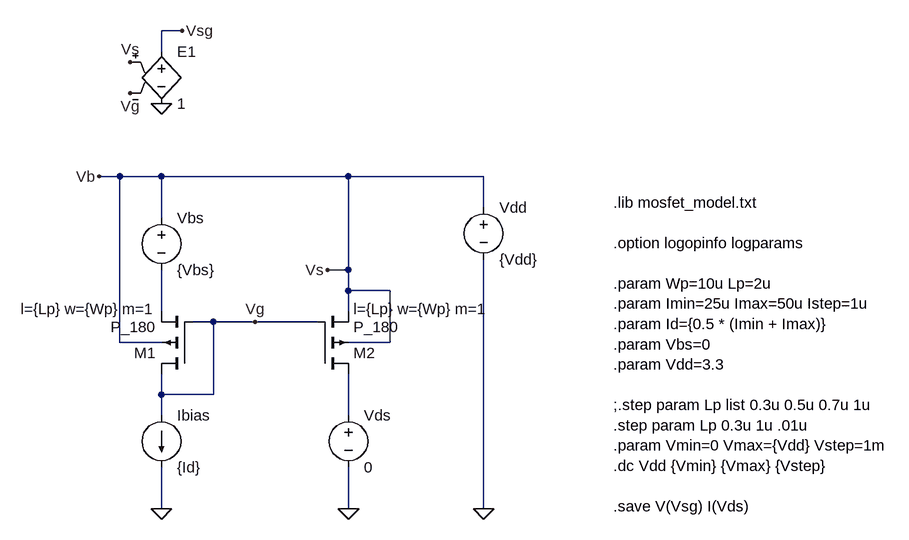
[diagram p0: schematic pmos_mirror.asc]
pmos_mirror.asc, the LTspice schematic file:
Version 4.1
SHEET 1 1372 680
WIRE 224 -416 192 -416
WIRE 192 -384 192 -416
WIRE 128 -192 96 -192
WIRE 192 -192 128 -192
WIRE 480 -192 192 -192
WIRE 688 -192 480 -192
WIRE 688 -144 688 -192
WIRE 192 -128 192 -192
WIRE 480 -48 480 -192
WIRE 480 -48 448 -48
WIRE 480 -16 480 -48
WIRE 544 -16 480 -16
WIRE 192 16 192 -48
WIRE 480 16 480 -16
WIRE 272 32 240 32
WIRE 336 32 272 32
WIRE 432 32 336 32
WIRE 128 64 128 -192
WIRE 192 64 128 64
WIRE 544 64 544 -16
WIRE 544 64 480 64
WIRE 192 144 192 112
WIRE 272 144 272 32
WIRE 272 144 192 144
WIRE 192 176 192 144
WIRE 480 176 480 112
WIRE 192 320 192 256
WIRE 480 320 480 256
WIRE 688 320 688 -64
FLAG 192 320 0
FLAG 688 320 0
FLAG 336 32 Vg
FLAG 96 -192 Vb
FLAG 480 320 0
FLAG 448 -48 Vs
FLAG 192 -304 0
FLAG 144 -320 Vg
FLAG 144 -368 Vs
FLAG 224 -416 Vsg
SYMBOL current 192 176 R0
SYMATTR InstName Ibias
SYMATTR Value {Id}
SYMBOL pmos4 240 112 R180
WINDOW 123 56 100 Left 2
SYMATTR Value2 l={Lp} w={Wp} m=1
SYMATTR InstName M1
SYMATTR Value P_180
SYMBOL voltage 192 -144 R0
SYMATTR InstName Vbs
SYMATTR Value {Vbs}
SYMBOL voltage 688 -160 R0
SYMATTR InstName Vdd
SYMATTR Value {Vdd}
SYMBOL pmos4 432 112 M180
WINDOW 123 56 100 Left 2
SYMATTR Value2 l={Lp} w={Wp} m=1
SYMATTR InstName M2
SYMATTR Value P_180
SYMBOL voltage 480 160 R0
SYMATTR InstName Vds
SYMATTR Value 0
SYMBOL e 192 -400 R0
SYMATTR InstName E1
SYMATTR Value 1
TEXT 888 -152 Left 2 !.lib mosfet_model.txt\n \n.option logopinfo logparams\n \n.param Wp=10u Lp=2u\n.param Imin=25u Imax=50u Istep=1u\n.param Id={0.5 * (Imin + Imax)}\n.param Vbs=0\n.param Vdd=3.3\n \n;.step param Lp list 0.3u 0.5u 0.7u 1u\n.step param Lp 0.3u 1u .01u\n.param Vmin=0 Vmax={Vdd} Vstep=1m\n.dc Vdd {Vmin} {Vmax} {Vstep}\n \n.save V(Vsg) I(Vds)

The netlist it stands for:
* pmos_mirror.asc
Ibias Vg 0 {Id}
M1 Vg Vg N001 Vs P_180 l={Lp} w={Wp} m=1
Vbs Vs N001 {Vbs}
Vdd Vs 0 {Vdd}
M2 N002 Vg Vs Vs P_180 l={Lp} w={Wp} m=1
Vds N002 0 0
E1 Vsg 0 Vs Vg 1
.model NMOS NMOS
.model PMOS PMOS
.lib standard.mos
.lib mosfet_model.txt
.option logopinfo logparams
.param Wp=10u Lp=2u
.param Imin=25u Imax=50u Istep=1u
.param Id={0.5 * (Imin + Imax)}
.param Vbs=0
.param Vdd=3.3
;.step param Lp list 0.3u 0.5u 0.7u 1u
.step param Lp 0.3u 1u .01u
.param Vmin=0 Vmax={Vdd} Vstep=1m
.dc Vdd {Vmin} {Vmax} {Vstep}
.save V(Vsg) I(Vds)
.backanno
.end